# EAGLE design STM32_new (EAGLE 9.6.2)
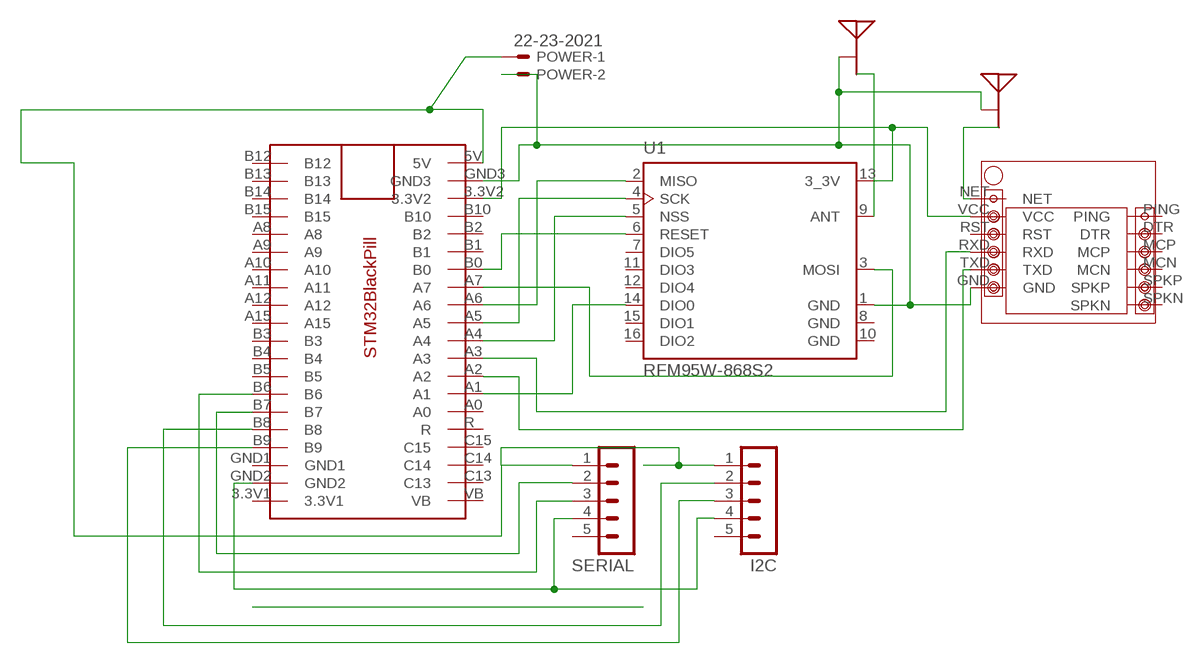
[diagram p0: schematic, sheet 1]

## Parts
I2C  MA05-1  [MA05-1]
POWER  22-23-2021  [22-23-2021]
SERIAL  MA05-1  [MA05-1]
SIM800L_NEW1  SIM800L_NEW  [SIM800L_NEW]
U1  RFM95W-868S2  [XCVR_RFM95W-868S2]
U$1  STM32BLACKPILL  [STM32BLACKPILL]
U$2  CHIP  [2450AT18B100]
U$3  CHIP  [2450AT18B100]

## Nets
N$1: I2C.1 POWER.1 SERIAL.1 U$1.5V
N$2: POWER.2 SIM800L_NEW1.GND U1.1(GND) U$1.GND3 U$2.GND U$3.GND
N$3: U1.6(RESET) U$1.B0
N$4: U1.4(SCK) U$1.A5
N$5: U1.2(MISO) U$1.A6
N$6: U1.3(MOSI) U$1.A7
N$7: U1.5(NSS) U$1.A4
N$8: U1.14(DIO0) U$1.A1
N$9: SIM800L_NEW1.TXD U$1.A2
N$10: SIM800L_NEW1.RXD U$1.A3
N$11: U1.9(ANT) U$2.FEED
N$12: SIM800L_NEW1.NET U$3.FEED
N$13: SIM800L_NEW1.VCC U1.13(3_3V) U$1.3.3V2
N$14: SERIAL.2 U$1.B7
N$15: SERIAL.3 U$1.B6
N$16: I2C.4 SERIAL.4 U$1.GND2
N$17: I2C.2 U$1.B8
N$18: I2C.3 U$1.B9
Unconnected: I2C.5 SERIAL.5 SIM800L_NEW1.DTR SIM800L_NEW1.MCN SIM800L_NEW1.MCP SIM800L_NEW1.PING SIM800L_NEW1.RST SIM800L_NEW1.SPKN SIM800L_NEW1.SPKP U1.7(DIO5) U1.11(DIO3) U1.12(DIO4) U1.15(DIO1) U1.16(DIO2) U$1.3.3V1 U$1.A0 U$1.A8 U$1.A9 U$1.A10 U$1.A11 U$1.A12 U$1.A15 U$1.B1 U$1.B2 U$1.B3 U$1.B4 U$1.B5 U$1.B10 U$1.B12 U$1.B13 U$1.B14 U$1.B15 U$1.C13 U$1.C14 U$1.C15 U$1.GND1 U$1.R U$1.VB

## Power pins joined to a net without a drawn wire
WE: U1.8(GND) U1.10(GND)

## Library data of the parts
I2C SERIAL = con-lstb:MA05-1: PIN HEADER; OC_FARNELL: unknown; OC_NEWARK: unknown
POWER = con-molex:22-23-2021: .100" (2.54mm) Center Header - 2 Pin; MF: MOLEX; MPN: 22-23-2021; OC_FARNELL: 1462926; OC_NEWARK: 25C3832
SIM800L_NEW1 = SIM800L_new:SIM800L_NEW
U1 = RFM95W-868S2:RFM95W-868S2: Mod Txrx Lora +20dbm 868mhz Smd Check availability <https://pricing.snapeda.com/parts/RFM95W-868S2/RF/view-part?ref=eda>; AVAILABILITY: In Stock; DESCRIPTION: General ISM < 1GHz LoRa™ Transceiver Module 868MHz Antenna Not Included Surface Mount; MF: RF; MP: RFM95W-868S2; PACKAGE: SMD-16 Hope Microelectronics; PRICE: None; PURCHASE-URL: https://pricing.snapeda.com/search/part/RFM95W-868S2/?ref=eda
U$1 = STM32BlackPill:STM32BLACKPILL
U$2 U$3 = antena:CHIP

## Board
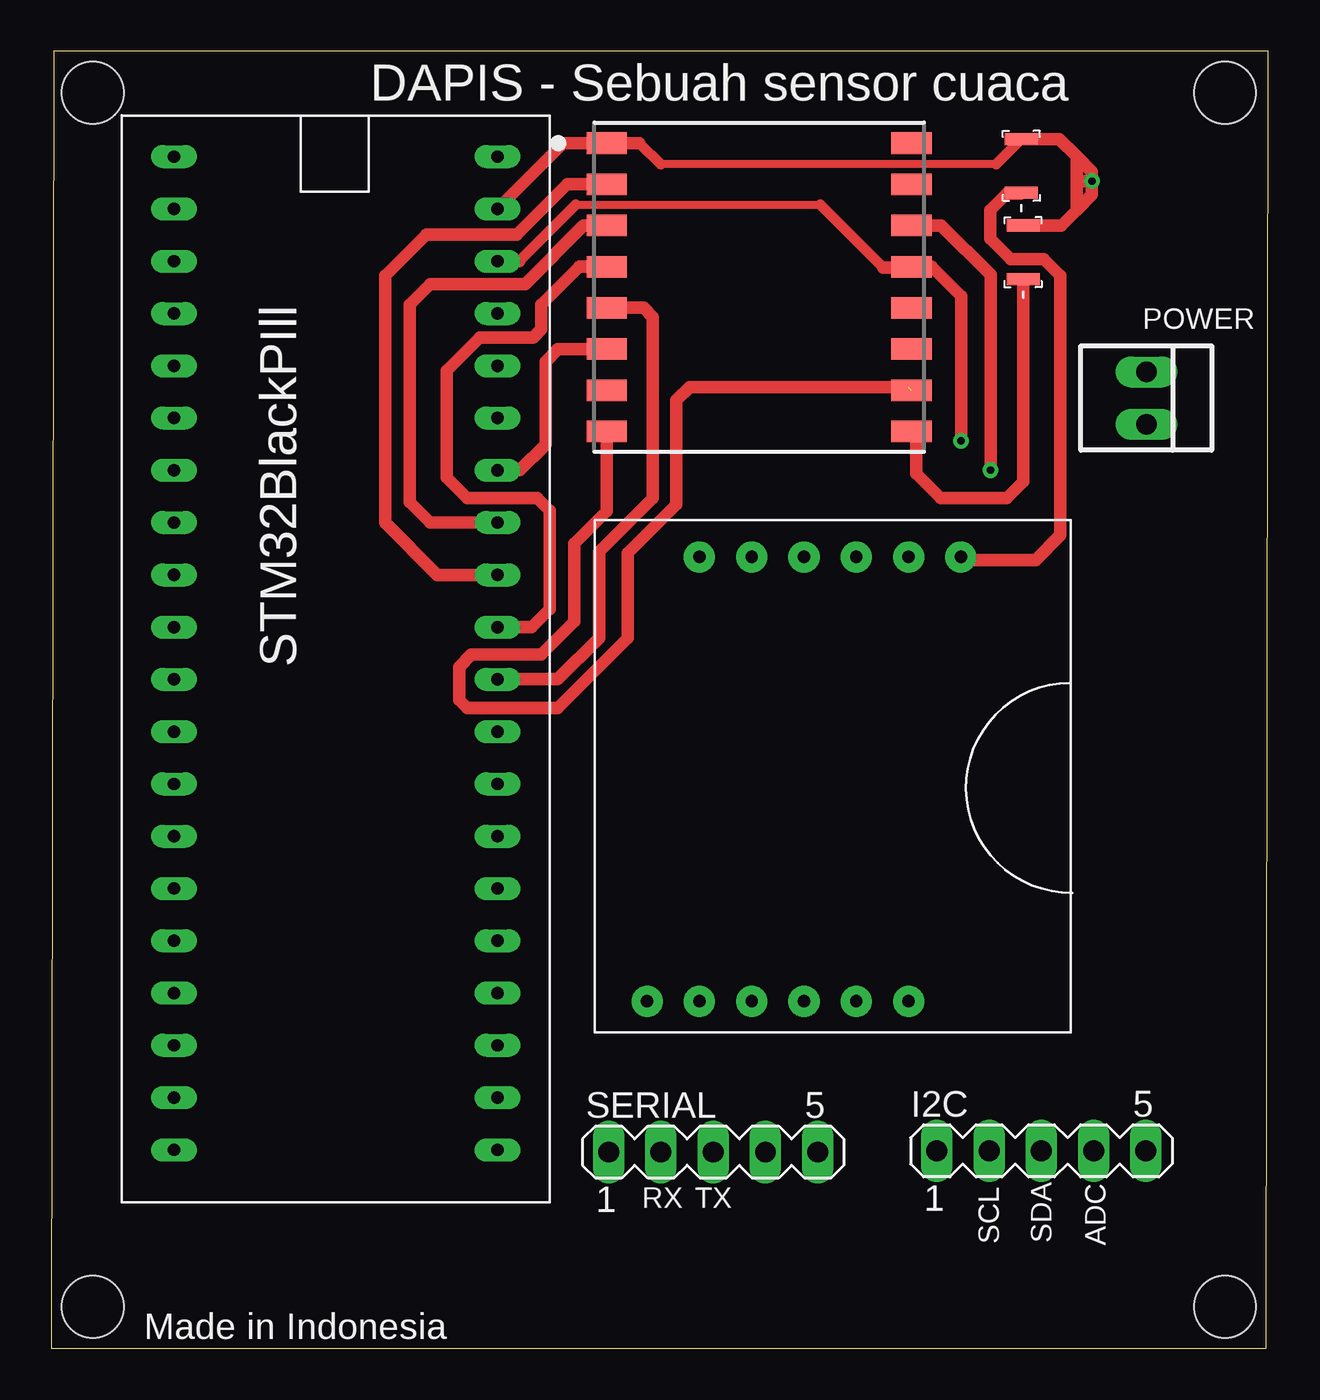
[diagram p1: board, top side]
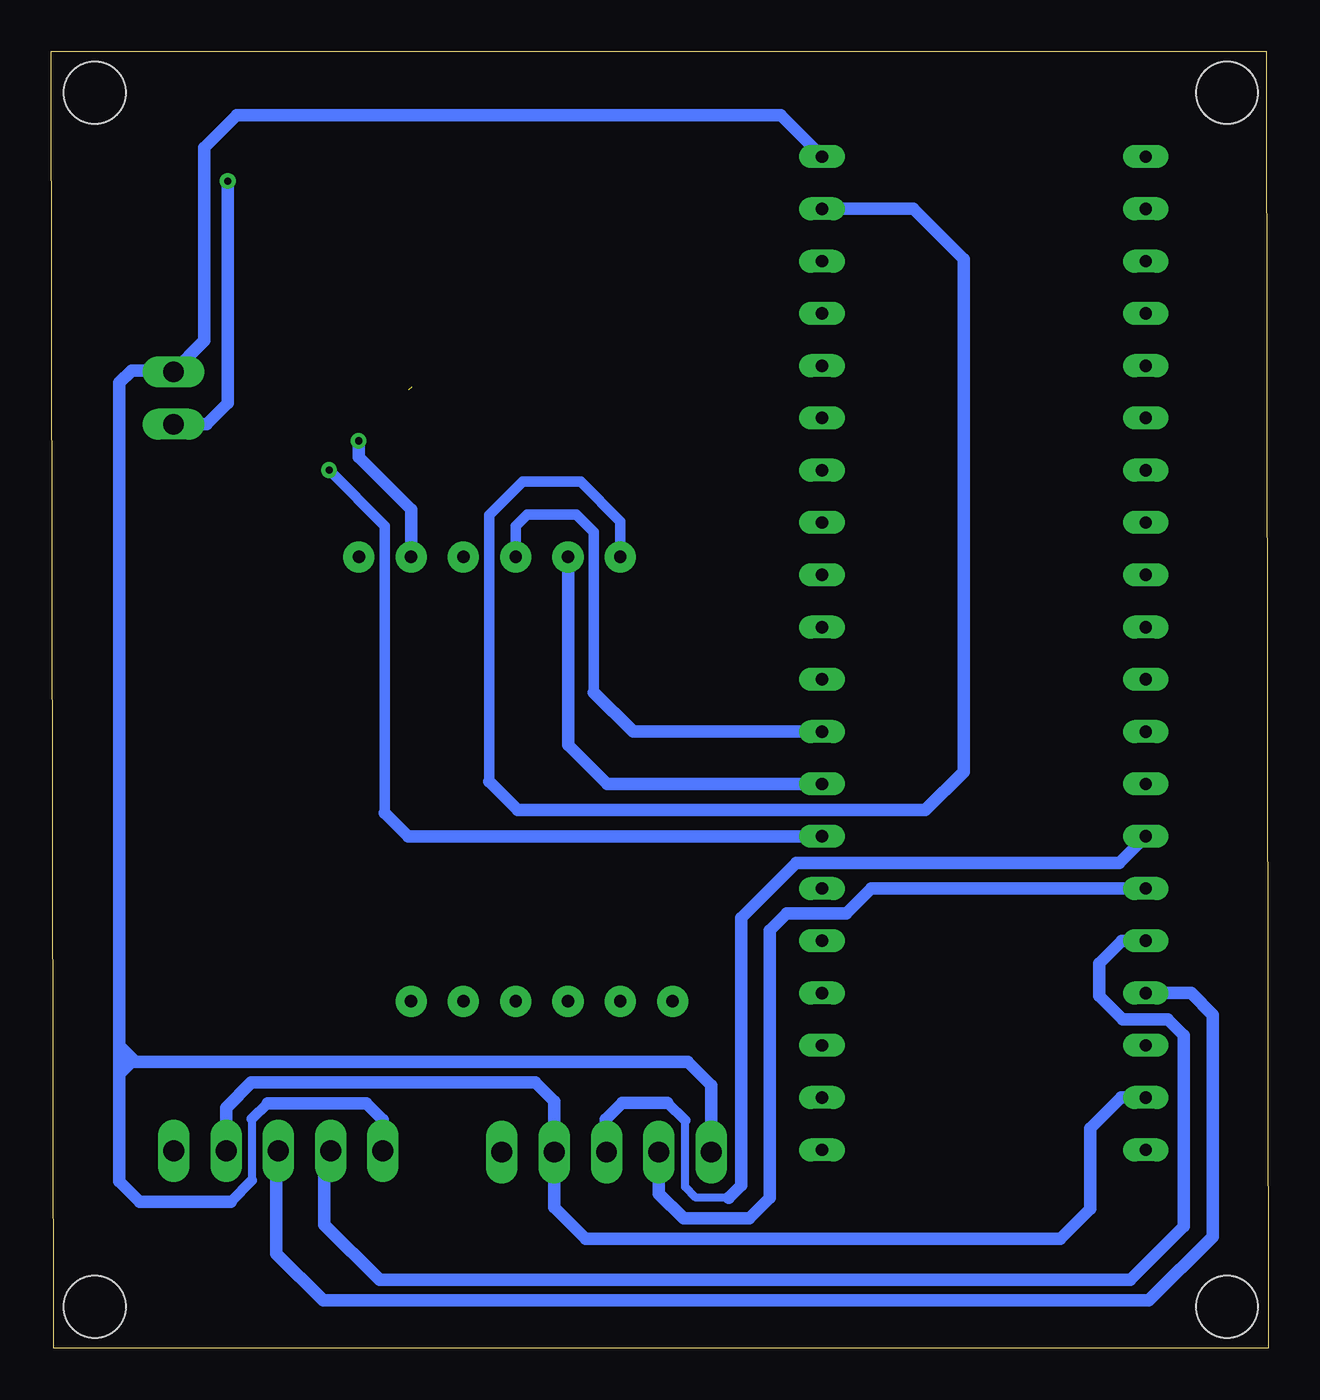
[diagram p2: board, bottom side, seen from below]

Size 59.1 x 63 mm. Coordinates in mm from the lower left corner, seen from the top.
Outline: 0,0 59,0 59.1,63 0.1,63 0,0
Copper layers (1*16): Top 0.035mm / dielectric 1.5mm / Bottom 0.035mm
Design rules "default": minimum track width 6mil, minimum drill 0.35mm, track to track 6mil, track to pad 6mil, pad to pad 6mil, via to via 6mil, smd to smd 6mil, copper to edge 40mil, drill to drill 6mil, minimum pad ring 10mil, minimum via ring 8mil, stop-mask expansion 4mil, vias tented up to drill 0mil, thermal gap 10mil
Holes 3 mm at 2,61 57,61 57,2 2,2

### Footprints (pad centres in the part's own frame; a part is rotated, then mirrored left to right if it is on the bottom)
MA05-1 = drill 1.016 long: 1 -5.08,0; 2 -2.54,0; 3 0,0; 4 2.54,0; 5 5.08,0
22-23-2021 = drill 1 long: 1 -1.27,0; 2 1.27,0
SIM800L_NEW = drill 0.6 pad 1.51: DTR 20.32,15.24; GND -1.27,7.62; MCN 20.32,10.16; MCP 20.32,12.7; NET -1.27,20.32; PING 20.32,17.78; RST -1.27,15.24; RXD -1.27,12.7; SPKN 20.32,5.08; SPKP 20.32,7.62; TXD -1.27,10.16; VCC -1.27,17.78
XCVR_RFM95W-868S2 = smd 1.95 x 1.05: 1 -7.4,7; 2 -7.4,5; 3 -7.4,3; 4 -7.4,1; 5 -7.4,-1; 6 -7.4,-3; 7 -7.4,-5; 8 -7.4,-7; 9 7.4,-7; 10 7.4,-5; 11 7.4,-3; 12 7.4,-1; 13 7.4,1; 14 7.4,3; 15 7.4,5; 16 7.4,7
STM32BLACKPILL = drill 0.6 long: 3.3V1 -8.1,-25.4; 3.3V2 7.62,17.78; 5V 7.62,22.86; A0 7.62,-12.7; A1 7.62,-10.16; A2 7.62,-7.62; A3 7.62,-5.08; A4 7.62,-2.54; A5 7.62,0; A6 7.62,2.54; A7 7.62,5.08; A8 -8.1,12.7; A9 -8.1,10.16; A10 -8.1,7.62; A11 -8.1,5.08; A12 -8.1,2.54; A15 -8.1,0; B0 7.62,7.62; B1 7.62,10.16; B2 7.62,12.7; B3 -8.1,-2.54; B4 -8.1,-5.08; B5 -8.1,-7.62; B6 -8.1,-10.16; B7 -8.1,-12.7; B8 -8.1,-15.24; B9 -8.1,-17.78; B10 7.62,15.24; B12 -8.1,22.86; B13 -8.1,20.32; B14 -8.1,17.78; B15 -8.1,15.24; C13 7.62,-22.86; C14 7.62,-20.32; C15 7.62,-17.78; GND1 -8.1,-20.32; GND2 -8.1,-22.86; GND3 7.62,20.32; R 7.62,-15.24; VB 7.62,-25.4
2450AT18B100 = smd 0.6 x 1.6: FEED -1.3,0; GND 1.3,0

### Placement (x,y rotation side)
I2C  48.08,9.58 0 top
POWER  53.18,46.16 270 top
SERIAL  32.14,9.52 0 top
SIM800L_NEW1  23.85,37.17 270 top
U1  34.37,51.54 0 top
U$1  14.05,35.03 0 top
U$2  47.19,53.24 90 top
U$3  47.11,57.44 90 top

### Tracks (layer width: path | path; a pad name or v marks a point on that pad's centre or on a via)
N$1
  Bottom 0.4: 49.36,11.14 49.36,8.14
  Bottom 0.5: 48.6,11.9 49.36,11.14 | 49.36,8.14 50.4,7.1
  Bottom 0.6: 43.1,9.48 I2C.1 43,11.1 43.8,11.9 48.6,11.9 | U$1.5V 23.68,59.9 50.09,59.9 51.67,58.32 51.67,48.94 POWER.1 53.25,47.5 55.2,47.5 55.8,46.9 55.8,14.7 | SERIAL.1 27.06,12.76 28.2,13.9 55,13.9 | 55,13.9 55.8,14.7 | 50.4,7.1 54.8,7.1 55.8,8.1 55.8,13.3 | 55.8,13.3 55.8,14.7 | 55,13.9 55.2,13.9 55.8,13.3
N$2  (via drill 0.35)
  Top 0.4: 45.89,57.52 29.58,57.52
  Top 0.5: 48.23,58.74 U$3.GND 45.89,57.52 | 29.58,57.52 28.56,58.54
  Top 0.6: U$1.GND3 24.86,58.54 U1.1 28.56,58.54 | U$3.GND 48.96,58.74 49.8,57.9 | 49.8,57.9 49.8,56.7 | 49.8,56.7 49.8,55.3 | 49.8,55.3 49.04,54.54 U$2.GND | 49.8,56.7 v50.54,56.7 | v50.54,56.7 50.54,56.04 49.8,55.3 | v50.54,56.7 50.54,57.16 49.8,57.9
  Bottom 0.152: 22,55 U$1.GND3
  Bottom 0.5: SIM800L_NEW1.GND 31.47,40.17 33.4,42.1 36.2,42.1 37.83,40.47 37.83,27.53
  Bottom 0.6: U$1.GND3 17.25,55.35 14.8,52.9 14.8,28 16.65,26.15 36.45,26.15 37.83,27.53 | v50.54,56.7 50.54,45.92 51.57,44.89 POWER.2
N$3
  Top 0.6: U$1.B0 22.75,42.65 24,43.9 24,47.94 24.6,48.54 U1.6
N$4
  Top 0.152: 22,35.5 U$1.A5
  Top 0.6: 26.83,52.54 U1.4 25.64,52.54 23.8,50.7 23.8,49.51 23.39,49.1 20.8,49.1 19.2,47.5 19.2,42.3 20.2,41.3 23.6,41.3 24.2,40.7 24.2,35.9 23.33,35.03 U$1.A5
N$5
  Top 0.6: U1.2 25.04,56.54 22.6,54.1 18.2,54.1 16.2,52.1 16.2,40.1 18.73,37.57 U$1.A6
N$6
  Top 0.152: 26.5,54.5 U1.3
  Top 0.6: U1.3 25.84,54.54 23,51.7 18.4,51.7 17.4,50.7 17.4,41.1 18.39,40.11 U$1.A7
N$7
  Top 0.6: U1.5 28.76,50.54 29.2,50.1 29.2,41.3 26.6,38.7 26.6,34.5 24.6,32.5 U$1.A4
N$8  (via drill 0.35)
  Top 0.6: U1.14 43.22,54.54 45.61,52.15 v45.61,42.66
  Bottom 0.5: v45.61,42.66 42.9,39.95 42.9,26
  Bottom 0.6: U$1.A1 41.77,24.87 42.9,26
N$9
  Bottom 0.6: SIM800L_NEW1.TXD 34.01,29.31 32.11,27.41 U$1.A2
N$10
  Bottom 0.5: SIM800L_NEW1.RXD 36.55,39.95 36,40.5 33.6,40.5 32.76,39.66 32.76,31.86
  Bottom 0.6: U$1.A3 30.85,29.95 32.76,31.86
N$11
  Top 0.6: U1.9 42,44.31 42,42.5 43.2,41.3 46.4,41.3 47.2,42.1 U$2.FEED
N$12
  Top 0.6: U$3.FEED 47.07,56.1 46.4,56.1 45.6,55.3 45.6,53.9 46.6,52.9 48.2,52.9 49,52.1 49,39.5 47.8,38.3 44.31,38.3 SIM800L_NEW1.NET
N$13  (via drill 0.35)
  Top 0.4: 25.46,55.56 37.34,55.56
  Top 0.5: 22.71,52.81 25.46,55.56 | 37.34,55.56 40.4,52.5
  Top 0.6: U$1.3.3V2 22.71,52.81 | 40.4,52.5 41.73,52.5 U1.13 42.76,52.54 44.18,51.12 v44.18,44.08
  Bottom 0.6: SIM800L_NEW1.VCC 41.63,40.73 44.18,43.28 v44.18,44.08
N$14
  Bottom 0.6: SERIAL.2 29.6,7.5 28.4,6.3 25.2,6.3 24.2,7.3 24.2,20.3 23.38,21.12 20.5,21.12 19.29,22.33 U$1.B7
N$15
  Bottom 0.4: 26.2,7.3 27.8,7.3 28.33,7.83 28.33,11.05
  Bottom 0.5: 28.33,11.05 29.19,11.91
  Bottom 0.6: U$1.B6 7.24,23.58 22.92,23.58 25.6,20.9 25.6,7.9 26.2,7.3 | SERIAL.3 32.19,9.57 32.19,11.11 31.39,11.91 29.19,11.91
N$16
  Bottom 0.6: I2C.4 50.62,11.68 49.4,12.9 35.6,12.9 34.68,11.98 SERIAL.4 34.68,6.83 33.16,5.31 10.1,5.31 8.65,6.76 8.65,10.67 7.15,12.17 U$1.GND2
N$17
  Bottom 0.6: I2C.2 45.85,9.27 45.85,6 43.16,3.31 6.7,3.31 4.1,5.91 4.1,15.2 4.87,15.97 7.07,15.97 8.2,17.1 8.2,18.7 7.11,19.79 U$1.B8
N$18
  Bottom 0.6: U$1.B9 3.75,17.25 2.7,16.2 2.7,5.41 5.8,2.31 45.9,2.31 48.18,4.59 48.18,9.48 I2C.3
WE  (1 unrouted)
  Top 0.6: U1.8 26.97,40.67 25.4,39.1 25.4,35.3 23.8,33.7 20.4,33.7 19.8,33.1 19.8,31.5 20.2,31.1 24.6,31.1 28,34.5 28,38.64 30.35,40.99 30.35,46.05 31,46.7 41.61,46.7

### Text on the board
tNames: DAPIS - Sebuah sensor cuaca | STM32BlackPIll | SERIAL | RX | TX | SCL | SDA | ADC | Made in Indonesia